# Altium schematic sheet hub.SchDoc
size Letter; SheetNumber: 2
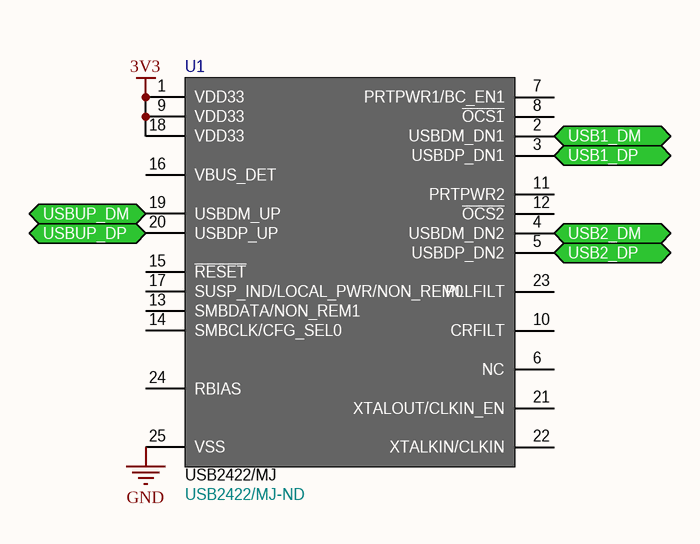
[diagram p0: hub.SchDoc]

## Parts
U1  USB2422/MJ  Supplier Part Number 1: USB2422/MJ-ND  [QFN50P400X400-24V2N]

## Ports
USB1_DM (bidir), USB1_DP (bidir), USB2_DM (bidir), USB2_DP (bidir), USBUP_DM (bidir), USBUP_DP (bidir)

## Nets
3V3: U1.1(VDD33) U1.9(VDD33) U1.18(VDD33)
GND: U1.25(VSS)
USB1_DM: U1.2(USBDM_DN1) ; port USB1_DM
USB1_DP: U1.3(USBDP_DN1) ; port USB1_DP
USB2_DM: U1.4(USBDM_DN2) ; port USB2_DM
USB2_DP: U1.5(USBDP_DN2) ; port USB2_DP
USBUP_DM: U1.19(USBDM_UP) ; port USBUP_DM
USBUP_DP: U1.20(USBDP_UP) ; port USBUP_DP

Not connected (* = marked no-connect by the designer): U1 6(NC) 7(PRTPWR1/BC_EN1) 8(~{OCS1}) 10(CRFILT) 11(PRTPWR2) 12(~{OCS2}) 13(SMBDATA/NON_REM1) 14(SMBCLK/CFG_SEL0) 15(~{RESET}) 16(VBUS_DET) 17(SUSP_IND/LOCAL_PWR/NON_REM0) 21(XTALOUT/CLKIN_EN) 22(XTALKIN/CLKIN) 23(PLLFILT) 24(RBIAS)

## Library data of the parts
U1 = USB2422/MJ: IC HUB CTLR USB 2.0 24QFN; Manufacturer: Microchip Technology; Function: Hub Controller; Standards: USB 2.0; Voltage - Supply: 3.3V; Supplier 1: Digi-Key; Manufacturer Part Number: USB2422/MJ; RoHS: RoHS Compliant; Category: Integrated Circuits (ICs); Stock 1: 2537; Pricing 1: 1=1.6, 25=1.3288, 100=1.2875 (USD); Packaging: Tray; Part Status: Active; Protocol: USB; Interface: USB; Current - Supply: -; Operating Temperature: 0°C ~ 70°C; Package / Case: 24-VFQFN Exposed Pad; Supplier Device Package: 24-QFN (4x4); Base Part Number: USB2422; ComponentLink1URL: http://www.microchip.com/mymicrochip/filehandler.aspx?ddocname=en566992; ComponentLink1Description: http://www.microchip.com/mymicrochip/filehandler.aspx?ddocname=en566992